# EAGLE design Temperature Sensor Rev.5 (EAGLE 7.6.0)
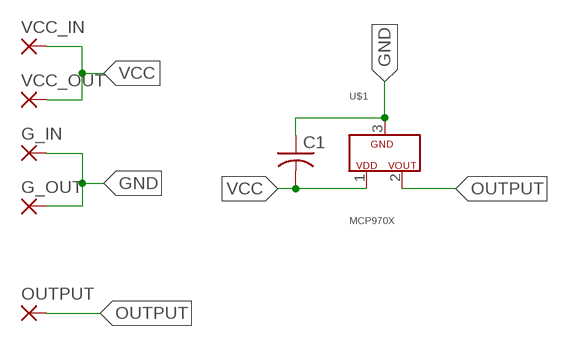
[diagram p0: schematic, sheet 1]

## Parts
C1  C-USC0603  [C0603]
G_IN  1,6/0,8  [1,6/0,8]
G_OUT  1,6/0,8  [1,6/0,8]
OUTPUT  1,6/0,8  [1,6/0,8]
U$1  MCP970X  [SOT23]
VCC_IN  1,6/0,8  [1,6/0,8]
VCC_OUT  1,6/0,8  [1,6/0,8]

## Nets
GND: C1.1 G_IN.1(P) G_OUT.1(P) U$1.3(GND)
OUTPUT: OUTPUT.1(P) U$1.2(VOUT)
VCC: C1.2 U$1.1(VDD) VCC_IN.1(P) VCC_OUT.1(P)

## Library data of the parts
C1 = adafruit:C-US: CAPACITOR, American symbol
G_IN G_OUT OUTPUT VCC_IN VCC_OUT = wirepad:1,6/0,8: THROUGH-HOLE PAD
U$1 = microchip:MCP970X: Temperature Sensor IC

## Board
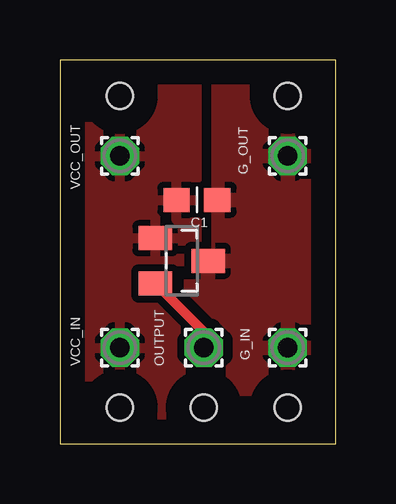
[diagram p1: board, top side]
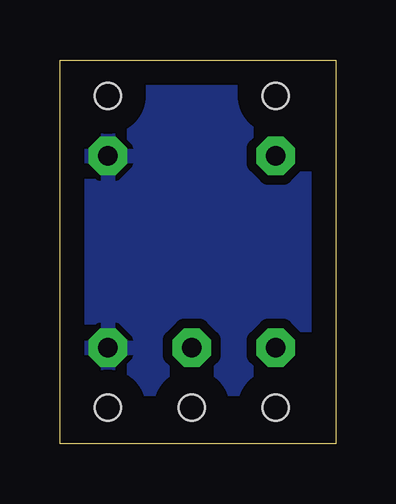
[diagram p2: board, bottom side, seen from below]

Size 11.5 x 16 mm. Coordinates in mm from the lower left corner, seen from the top.
Outline: 0,0 11.5,0 11.5,16 0,16 0,0
Copper layers (1*16): Top 0.035mm / dielectric 1.5mm / Bottom 0.035mm
Design rules "default": minimum track width 10mil, minimum drill 24mil, track to track 8mil, track to pad 8mil, pad to pad 8mil, via to via 8mil, smd to smd 8mil, copper to edge 40mil, drill to drill 8mil, minimum pad ring 10mil, minimum via ring 8mil, stop-mask expansion 4mil, vias tented up to drill 0mil, thermal gap 10mil
Holes 1.1 mm at 2.5,1.5 6,1.5 9.5,1.5 9.5,14.5 2.5,14.5

### Footprints (pad centres in the part's own frame; a part is rotated, then mirrored left to right if it is on the bottom)
C0603 = smd 1.1 x 1: 1 -0.85,0; 2 0.85,0
1,6/0,8 = drill 0.813 pad 1.6 octagon: 1 0,0
SOT23 = smd 1 x 1.4: 1 -0.95,-1.1; 2 0.95,-1.1; 3 0,1.1

### Placement (x,y rotation side)
C1  5.71,10.16 180 top
G_IN  9.5,4 0 top
G_OUT  9.5,12 0 top
OUTPUT  6,4 0 top
U$1  5.08,7.62 270 top
VCC_IN  2.5,4 0 top
VCC_OUT  2.5,12 0 top

### Tracks (layer width: path | path; a pad name or v marks a point on that pad's centre or on a via)
GND
  pour Top (isolate 0.406, rank 6): 0,0 11.5,0 11.5,16 0,16
  pour Bottom (isolate 0.406, rank 6): 0,0 11.5,0 11.5,16 0,16
OUTPUT
  Top 0.406: U$1.2 6,4.65 OUTPUT.1
VCC
  pour Top (isolate 0.305): 0,0 5.71,0 5.71,15.88 0,15.88